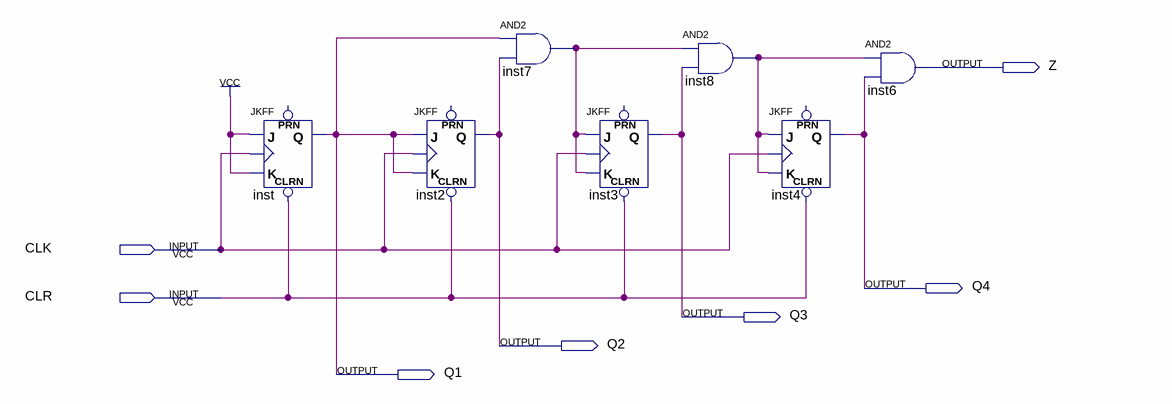
[diagram p0: schematic sheet]
// Quartus schematic tong.bdf as structural Verilog: 7 symbols, 7 pins
module tong (
  input  CLK,
  input  CLR,
  output Z,
  output Q4,
  output Q3,
  output Q2,
  output Q1
);

  wire inst7_out, inst8_out;

  JKFF inst (.CLRN(CLR), .K(1'b1), .J(1'b1), .CLK(CLK), .Q(Q1));  // open: PRN
  JKFF inst2 (.CLRN(CLR), .K(Q1), .J(Q1), .CLK(CLK), .Q(Q2));  // open: PRN
  and inst7 (inst7_out, Q1, Q2);
  JKFF inst3 (.CLRN(CLR), .K(inst7_out), .J(inst7_out), .CLK(CLK), .Q(Q3));  // open: PRN
  and inst8 (inst8_out, inst7_out, Q3);
  JKFF inst4 (.CLRN(CLR), .K(inst8_out), .J(inst8_out), .CLK(CLK), .Q(Q4));  // open: PRN
  and inst6 (Z, inst8_out, Q4);
endmodule
